# EAGLE schematic holo clock (EAGLE 6.2)
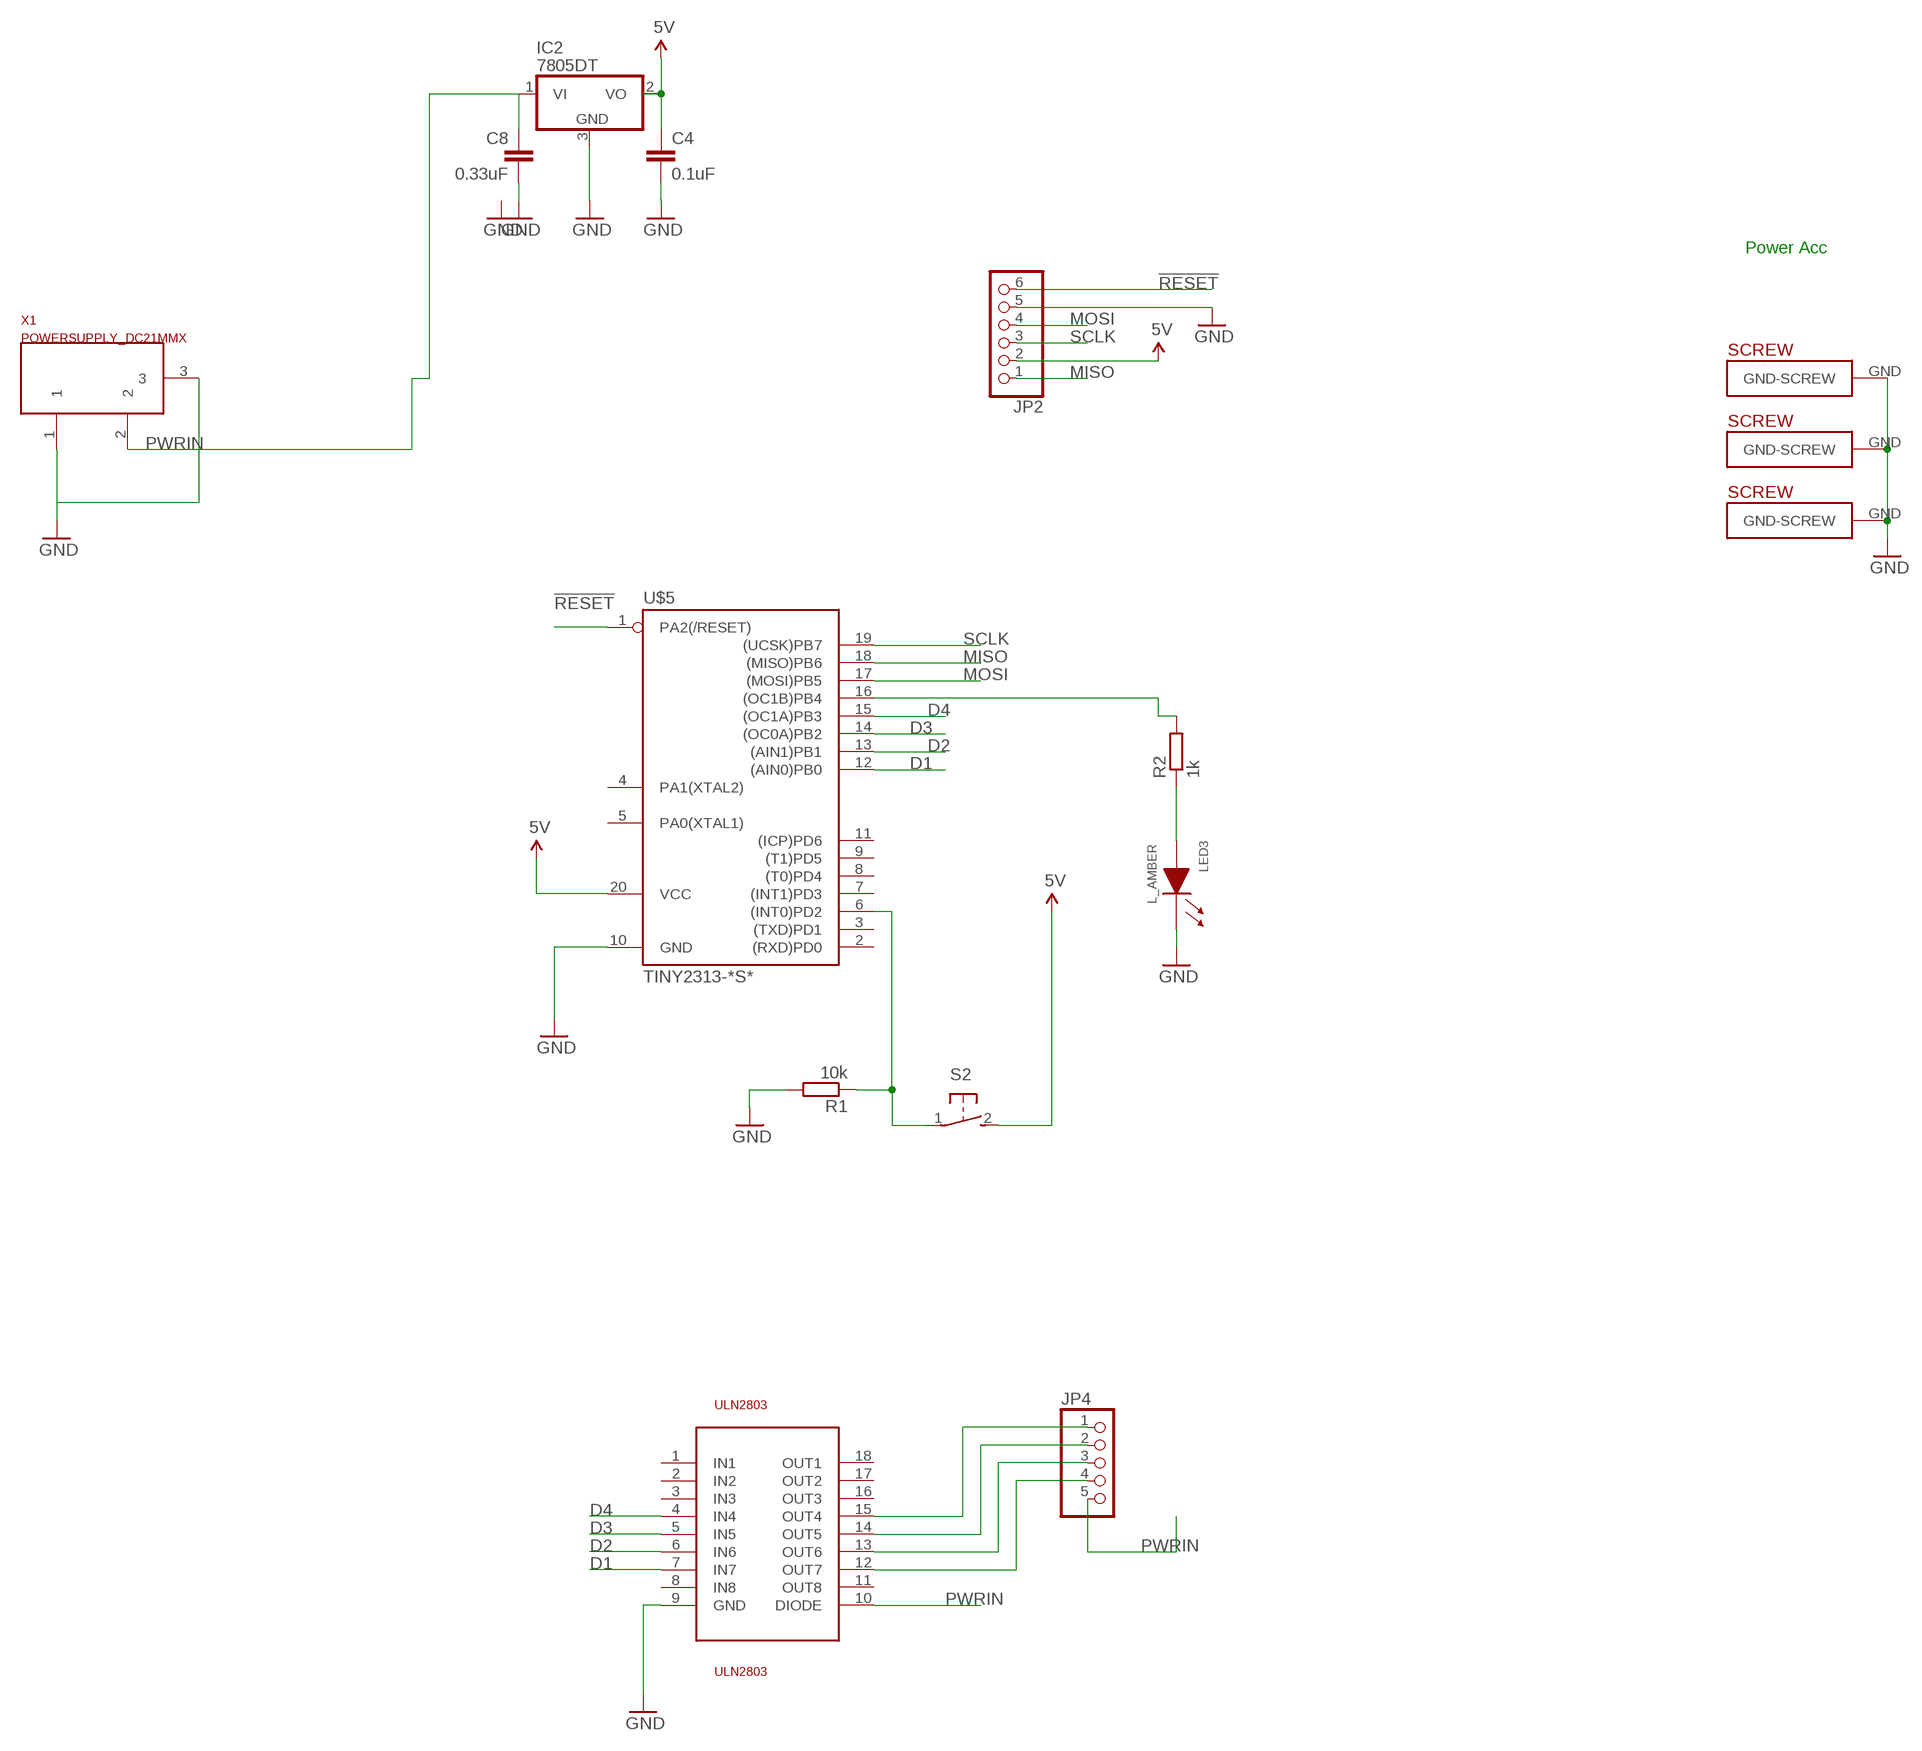
[diagram p0: schematic, sheet 1]

## Parts
C4  0.1uF  CAPPTH2  [CAP-PTH-SMALL2]
C8  0.33uF  CAPPTH2  [CAP-PTH-SMALL2]
IC2  7805DT  [TO252]
JP2  PINHD-1X6  [1X06]
JP4  PINHD-1X5  [1X05]
LED3  L_AMBER  LED0805  [LED0805]
R1  10k  R-EU_R0805  [R0805]
R2  1k  R-EU_R0805  [R0805]
S2  31-XX  [B3F-31XX]
U$5  TINY2313-*S*  [SO20L$]
U$14  PLATED-SCREW  [PLATEDSCREW]
U$17  PLATED-SCREW  [PLATEDSCREW]
U$18  PLATED-SCREW  [PLATEDSCREW]
ULN2803  ULN2803  [SO18L]
X1  POWERSUPPLY_DC21MMX  [POWERSUPPLY_DC-21MM]

## Nets
5V: C4.1 IC2.2(VO) JP2.2 S2.2(S) U$5.20(VCC)
!RESET: JP2.6 U$5.1(PA2(/RESET))
D1: U$5.12((AIN0)PB0) ULN2803.7(IN7)
D2: U$5.13((AIN1)PB1) ULN2803.6(IN6)
D3: U$5.14((OC0A)PB2) ULN2803.5(IN5)
D4: U$5.15((OC1A)PB3) ULN2803.4(IN4)
GND: C4.2 C8.2 IC2.3(GND) JP2.5 LED3.1(CA) R1.2 U$5.10(GND) U$14.GND(GND-SCREW) U$17.GND(GND-SCREW) U$18.GND(GND-SCREW) ULN2803.9(GND) X1.1 X1.3
MISO: JP2.1 U$5.18((MISO)PB6)
MOSI: JP2.4 U$5.17((MOSI)PB5)
N$1: JP4.1 ULN2803.15(OUT4)
N$2: R2.2 U$5.16((OC1B)PB4)
N$3: JP4.2 ULN2803.14(OUT5)
N$4: JP4.3 ULN2803.13(OUT6)
N$5: JP4.4 ULN2803.12(OUT7)
N$7: LED3.2(AN) R2.1
N$8: R1.1 S2.1(P) U$5.6((INT0)PD2)
PWRIN [power]: C8.1 IC2.1(VI) JP4.5 ULN2803.10(DIODE) X1.2
SCLK: JP2.3 U$5.19((UCSK)PB7)
Unconnected: U$5.2((RXD)PD0) U$5.3((TXD)PD1) U$5.4(PA1(XTAL2)) U$5.5(PA0(XTAL1)) U$5.7((INT1)PD3) U$5.8((T0)PD4) U$5.9((T1)PD5) U$5.11((ICP)PD6) ULN2803.1(IN1) ULN2803.2(IN2) ULN2803.3(IN3) ULN2803.8(IN8) ULN2803.11(OUT8) ULN2803.16(OUT3) ULN2803.17(OUT2) ULN2803.18(OUT1)

## Notes on the sheet
- Power Acc

## Library data of the parts
C4 C8 = SparkFun:CAP: Capacitor Standard 0603 ceramic capacitor, and 0.1" leaded capacitor.
IC2 = linear:78*: Positive VOLTAGE REGULATOR Source: http://cache.national.com/ds/LM/LM78L05.pdf http://www.fairchildsemi.com/ds/LM/LM7805.pdf
JP2 = pinhead:PINHD-1X6: PIN HEADER
JP4 = pinhead:PINHD-1X5: PIN HEADER
LED3 = MySMD:LED0805
R1 R2 = resistor:R-EU_: RESISTOR, European symbol
S2 = switch-omron:31-XX: OMRON SWITCH; MPN: B3F-3100; OC_FARNELL: 959704; OC_NEWARK: 36M3582
U$5 = avr-7:TINY2313*: Atmel Tiny2313 2K Flash, 128 bytes EEPROM, 128 bytes RAM
U$14 U$17 U$18 = Sanguinololu:PLATED-SCREW
ULN2803 = uln2803:ULN2803
X1 = SmartPrj:POWERSUPPLY_DC21MM